# EAGLE design Node_1 (EAGLE 9.6.2)
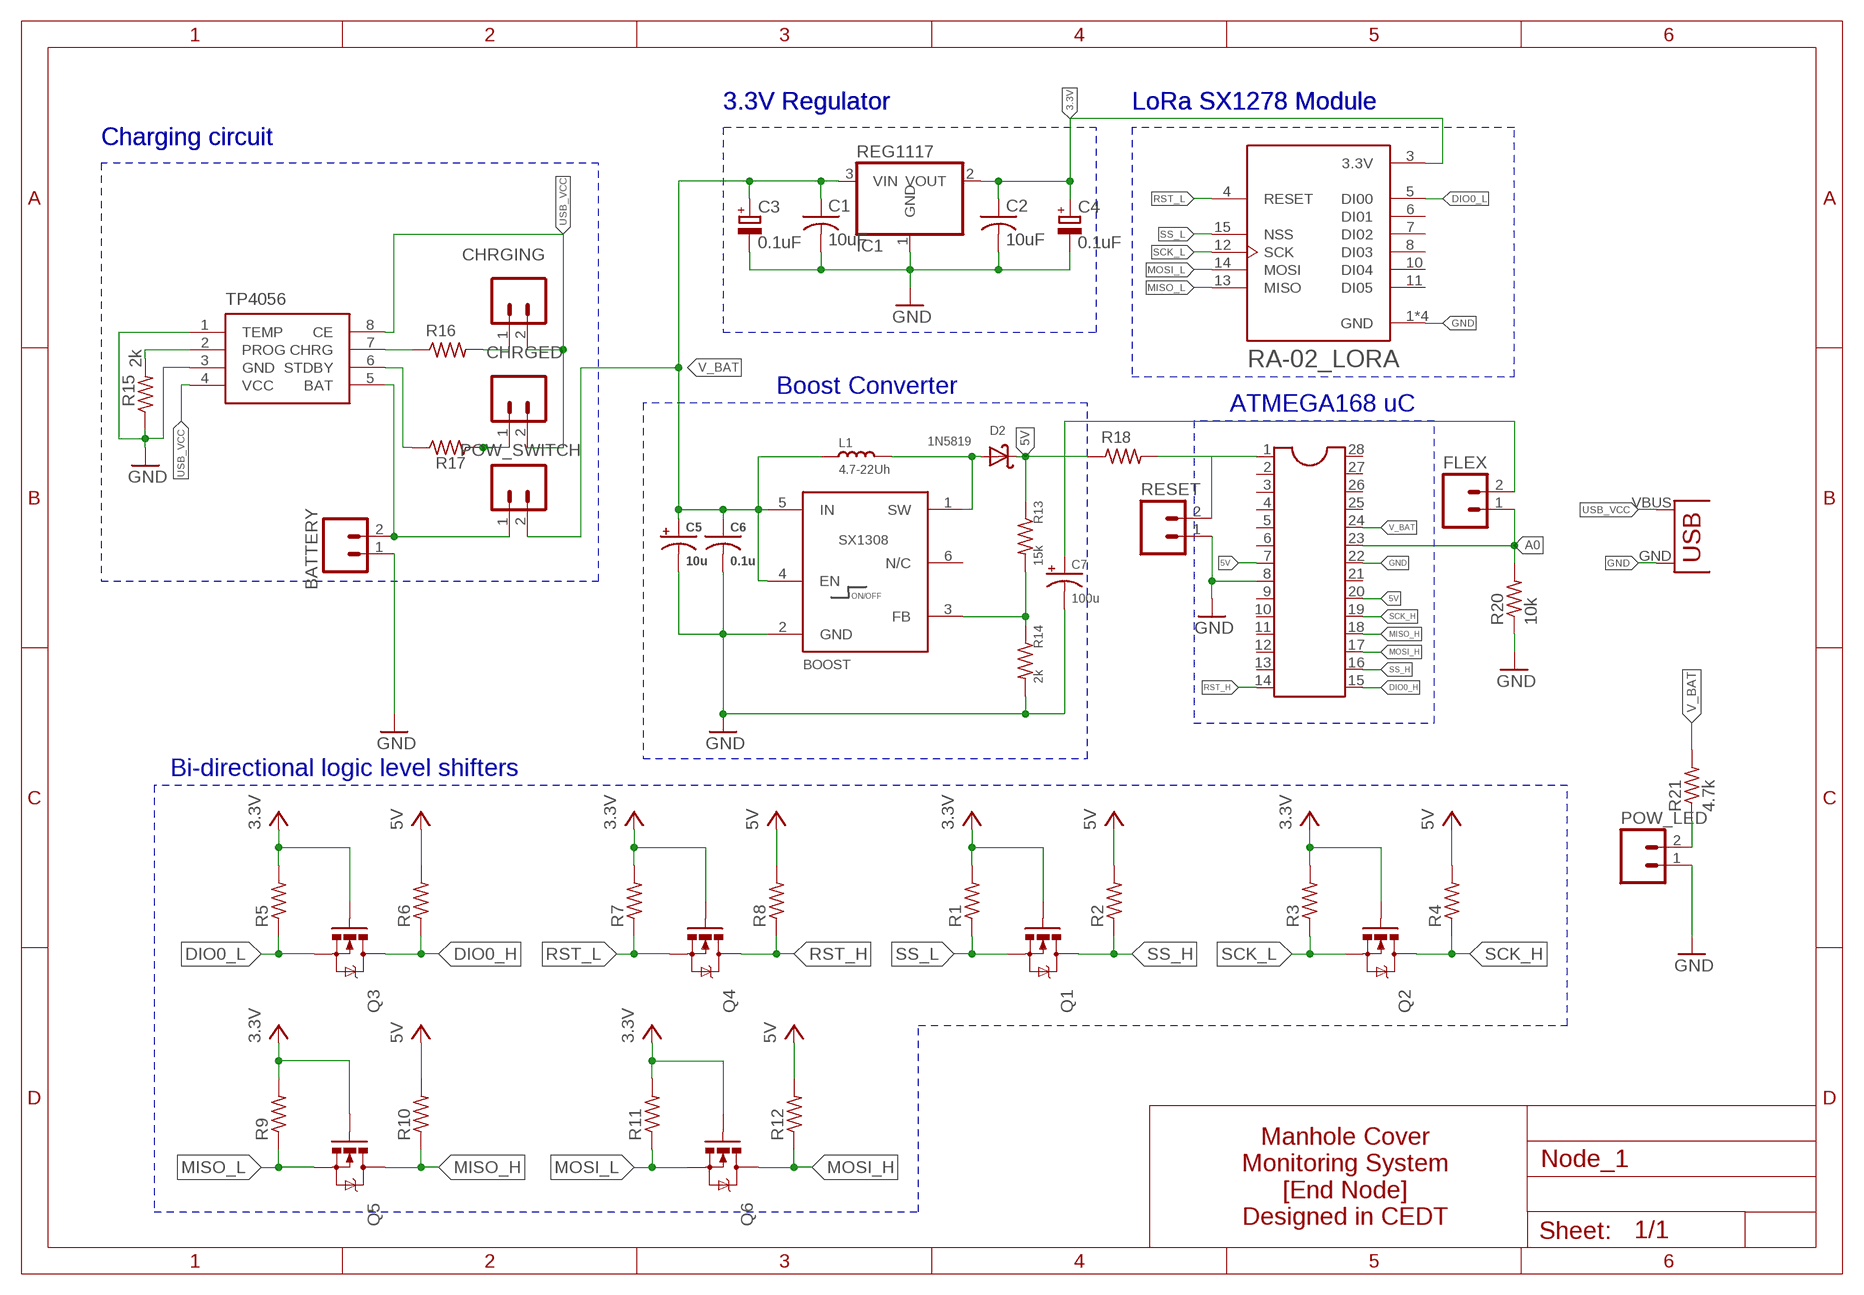
[diagram p0: schematic, sheet 1]

## Parts
ATMEGA168  DIL28-3  [DIL28-3]
BATTERY  M02  [02P]
BOOST  SX1308  [SOT-23-6]
C1  10uF  CAP0805  [C0805]
C2  10uF  CAP0805  [C0805]
C3  0.1uF  C-POL_TANTALUM-1411(3528-METRIC)  [CAPMP3528X210N]
C4  0.1uF  C-POL_TANTALUM-1411(3528-METRIC)  [CAPMP3528X210N]
C5  10u  CAP_POL_16V  [B/3528-21R]
C6  0.1u  CAP0603  [C0603]
C7  100u  CAP_POL_10V  [C/6032-28R]
CHRGED  M02  [02P]
CHRGING  M02  [02P]
D2  1N5819  [DO41-10]
FLEX  M02  [02P]
IC1  REG1117  [SOT223]
L1  4.7-22Uh  INDUCTOR/FERRITE-BEAD6X8H  [INDUCTOR_INT2-3.5-D6.5XH8.0MM]
POW_LED  M02  [02P]
POW_SWITCH  M02  [02P]
Q1  MOSFET-NCHANNELBSS138  [SOT23]
Q2  MOSFET-NCHANNELBSS138  [SOT23]
Q3  MOSFET-NCHANNELBSS138  [SOT23]
Q4  MOSFET-NCHANNELBSS138  [SOT23]
Q5  MOSFET-NCHANNELBSS138  [SOT23]
Q6  MOSFET-NCHANNELBSS138  [SOT23]
R1  RESISTOR0805  [R0805]
R2  RESISTOR0805  [R0805]
R3  RESISTOR0805  [R0805]
R4  RESISTOR0805  [R0805]
R5  RESISTOR0805  [R0805]
R6  RESISTOR0805  [R0805]
R7  RESISTOR0805  [R0805]
R8  RESISTOR0805  [R0805]
R9  RESISTOR0805  [R0805]
R10  RESISTOR0805  [R0805]
R11  RESISTOR0805  [R0805]
R12  RESISTOR0805  [R0805]
R13  15k  R-US_M0805  [M0805]
R14  2k  R-US_M0805  [M0805]
R15  2k  RESISTOR0805  [R0805]
R16  470  RESISTOR0207/7  [0207/7]
R17  470  RESISTOR0207/7  [0207/7]
R18  10k  RESISTOR0207/7  [0207/7]
R20  10k  R-US_0207/10  [0207/10]
R21  4.7k  RESISTOR0207/7  [0207/7]
RESET  M02  [02P]
TP4056  TP4056  [SOP-8]
U1  RA-02_LORA  [MODULE_RA-02_LORA]
U$1  USB(POWER)  [USB(POWER)]

## Nets
3.3V [shifter]: C2.1 C4.1(+) IC1.2(VOUT) Q1.1(G) Q2.1(G) Q3.1(G) Q4.1(G) Q5.1(G) Q6.1(G) R1.2 R3.2 R5.2 R7.2 R9.2 R11.2 U1.3(3.3V) ; supply symbol labelled VCC
5V: ATMEGA168.7 ATMEGA168.20 C7.+ D2.C FLEX.2 R2.2 R4.2 R6.2 R8.2 R10.2 R12.2 R13.1 R18.1 ; supply symbol labelled VCC
A0: ATMEGA168.23 FLEX.1 R20.2
BAT: BATTERY.2 POW_SWITCH.1 TP4056.5(BAT)
DIO0_H [shifter]: ATMEGA168.15 Q3.3(D) R6.1
DIO0_L [shifter]: Q3.2(S) R5.1 U1.5(DI00)
GND: ATMEGA168.8 ATMEGA168.22 BATTERY.1 BOOST.2(GND) C1.2 C2.2 C3.2(-) C4.2(-) C5.- C6.2 C7.- IC1.1(GND) POW_LED.1 R14.2 R15.1 R20.1 RESET.1 TP4056.1(TEMP) TP4056.3(GND) U1.1(GND) U1.2(GND) U1.9(GND) U1.16(GND) U$1.GND
MISO_H [shifter]: ATMEGA168.18 Q5.3(D) R10.1
MISO_L [shifter]: Q5.2(S) R9.1 U1.13(MISO)
MOSI_H [shifter]: ATMEGA168.17 Q6.3(D) R12.1
MOSI_L [shifter]: Q6.2(S) R11.1 U1.14(MOSI)
N$1: BOOST.1(SW) D2.A L1.2
N$2: R15.2 TP4056.2(PROG)
N$3: R16.1 TP4056.7(CHRG)
N$4: POW_LED.2 R21.1
N$6: BOOST.3(FB) R13.2 R14.1
N$7: R17.1 TP4056.6(STDBY)
N$8: CHRGING.1 R16.2
N$9: ATMEGA168.1 R18.2 RESET.2
N$10: CHRGED.1 R17.2
RST_H [shifter]: ATMEGA168.14 Q4.3(D) R8.1
RST_L [shifter]: Q4.2(S) R7.1 U1.4(RESET)
SCK_H [shifter]: ATMEGA168.19 Q2.3(D) R4.1
SCK_L [shifter]: Q2.2(S) R3.1 U1.12(SCK)
SS_H [shifter]: ATMEGA168.16 Q1.3(D) R2.1
SS_L [shifter]: Q1.2(S) R1.1 U1.15(NSS)
USB_VCC: CHRGED.2 CHRGING.2 TP4056.4(VCC) TP4056.8(CE) U$1.VBUS(VCC)
V_BAT: ATMEGA168.24 BOOST.4(EN) BOOST.5(IN) C1.1 C3.1(+) C5.+ C6.1 IC1.3(VIN) L1.1 POW_SWITCH.2 R21.2
Unconnected: ATMEGA168.2 ATMEGA168.3 ATMEGA168.4 ATMEGA168.5 ATMEGA168.6 ATMEGA168.9 ATMEGA168.10 ATMEGA168.11 ATMEGA168.12 ATMEGA168.13 ATMEGA168.21 ATMEGA168.25 ATMEGA168.26 ATMEGA168.27 ATMEGA168.28 BOOST.6(N/C) U1.6(DI01) U1.7(DI02) U1.8(DI03) U1.10(DI04) U1.11(DI05)

## Notes on the sheet
- 3.3V Regulator | 3.3V Regulator | LoRa SX1278 Module | LoRa SX1278 Module
- Charging circuit | Charging circuit
- Boost Converter
- ATMEGA168 uC
- Bi-directional logic level shifters
- Manhole Cover
  Monitoring System
  [End Node]
  Designed in CEDT

## Library data of the parts
ATMEGA168 = ic-package:DIL28: Dual In Line
BATTERY CHRGED CHRGING FLEX POW_LED POW_SWITCH RESET = CEDT_JANUARY_2015_v6:M02: AMP QUICK CONNECTOR
BOOST = SX1308:SX1308: SX1308 – 1.2MHz, 2A Step Up Converter – Suosemi; AVAILABILITY: Unavailable; DESCRIPTION: RF IC Gateway GPS 64-QFN (9x9); MF: Semtech Corporation; MP: SX1308; PACKAGE: - Semtech Corporation; PRICE: None
C1 C2 = CEDT_JANUARY_2015_v6:CAP
C3 C4 = Capacitor:C-POL: Capacitor Polarised - Generic; CATEGORY: Capacitor
C5 = CEDT_JANUARY_2015_v5:CAP_POL
C6 = CEDT_JANUARY_2015_v5:CAP
C7 = CEDT_JANUARY_2015_v7:CAP_POL; OC_FARNELL: unknown
D2 = CEDT_JANUARY_2015_v5:1N5819: DIODE general purpose rectifier, 1 A; OC_FARNELL: unknown
IC1 = CEDT_JANUARY_2015_v6:REG1117: 800mA and 1A Low Dropout (LDO) Positive Regulator 1.8V, 2.5V, 2.85V, 3.3V, 5V, and Adj
L1 = BeagleBone_Blue_R3:INDUCTOR/FERRITE-BEAD
Q1-Q6 = BeagleBone_Blue_R3:MOSFET-NCHANNEL: Common NMOSFET Parts MFG P/N Store ID Prod ID FDD8780 TRANS-09984 SI7820DN TRANS-11055 FDS6630A IC-08089 2N7002PW TRANS-11151 FQP30N06L COM-10213 TRANS-10060 BSS123LT1G TRANS-08345 BSS138 TRANS-00830 BS170 2N7000; PROD_ID: TRANS-00830
R1-R12 R21 = CEDT_JANUARY_2015_v6:RESISTOR
R13 R14 R20 = rcl:R-US_: RESISTOR, American symbol; SPICEPREFIX: R
R15 = CEDT_JANUARY_2015_v6:RESISTOR; OC_FARNELL: unknown
R16-R18 = CEDT_JANUARY_2015_v5:RESISTOR; OC_FARNELL: unknown
TP4056 = TP4056:TP4056
U1 = RA-02_LORA:RA-02_LORA: Ra-02 LoRa RF M5Stack Platform Evaluation Expansion Board Check availability <https://pricing.snapeda.com/parts/Ra-02%20LoRa/AI-Thinker/view-part?ref=eda>; AVAILABILITY: In Stock; DESCRIPTION: Ra-02 LoRa RF M5Stack Platform Evaluation Expansion Board; MF: AI-Thinker; MP: Ra-02 LoRa; PACKAGE: None; PRICE: None; PURCHASE-URL: https://pricing.snapeda.com/search/part/Ra-02 LoRa/?ref=eda
U$1 = CEDT_JANUARY_2015_v6:USB(POWER)

## Net classes
0 default: width 0.406 mm
1 POWER: width 0.61 mm, drill 0.7 mm, clearance 0.25 mm
2 shifter: width 0.305 mm

## Board
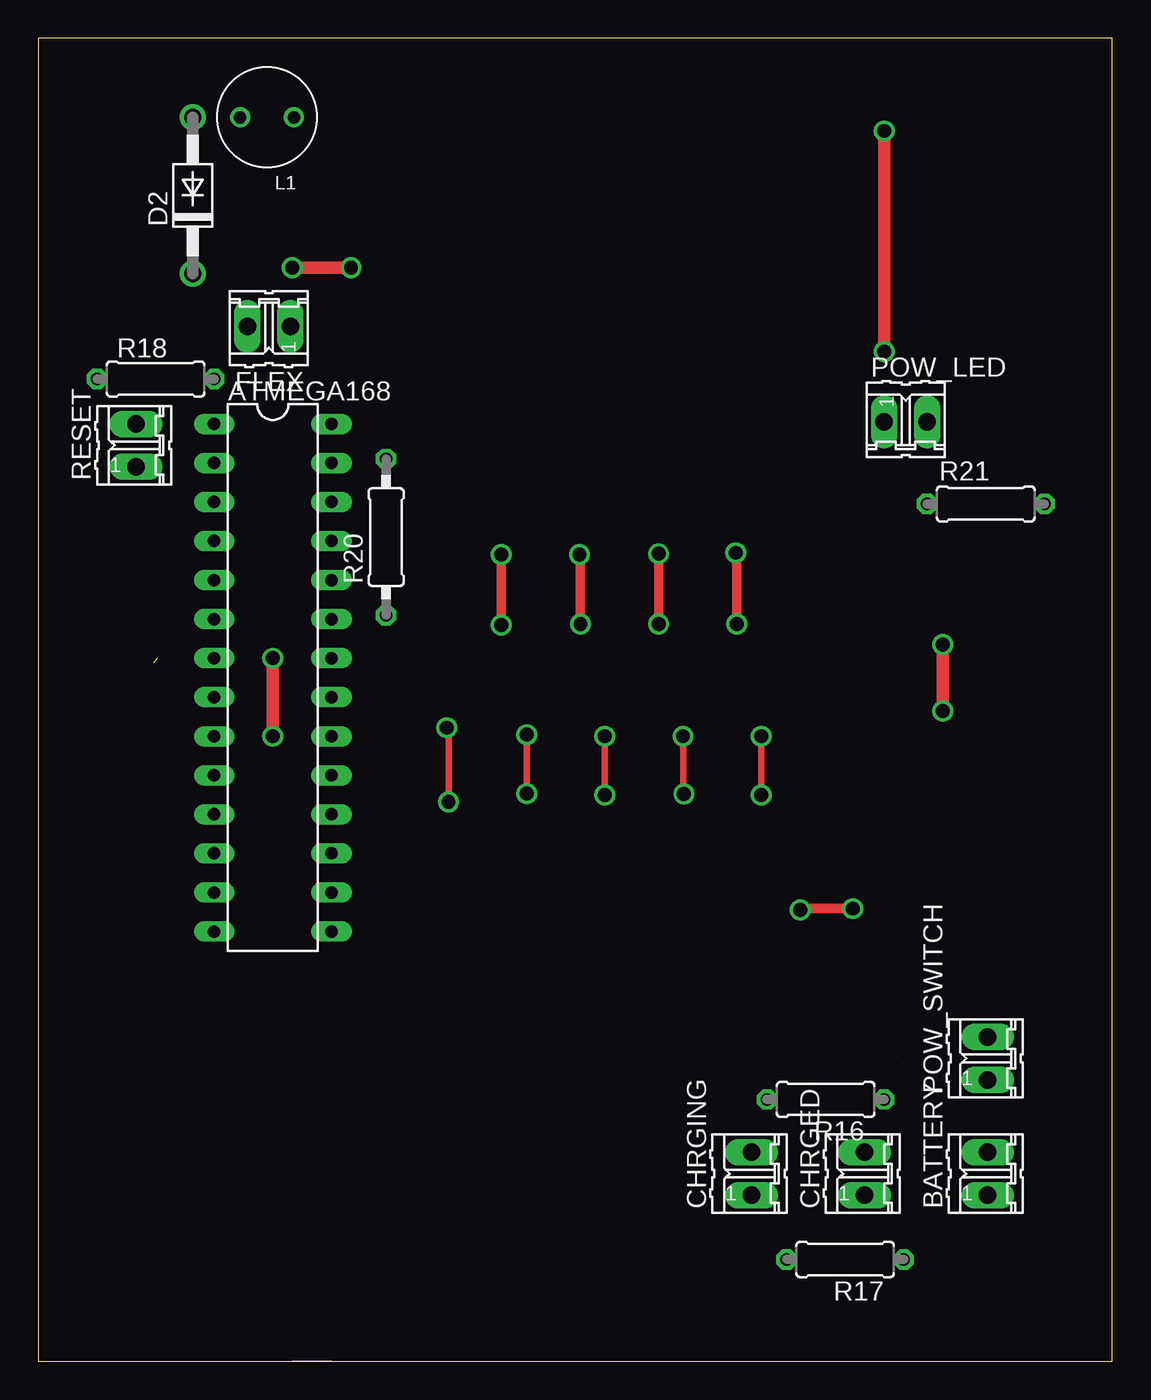
[diagram p1: board, top side]
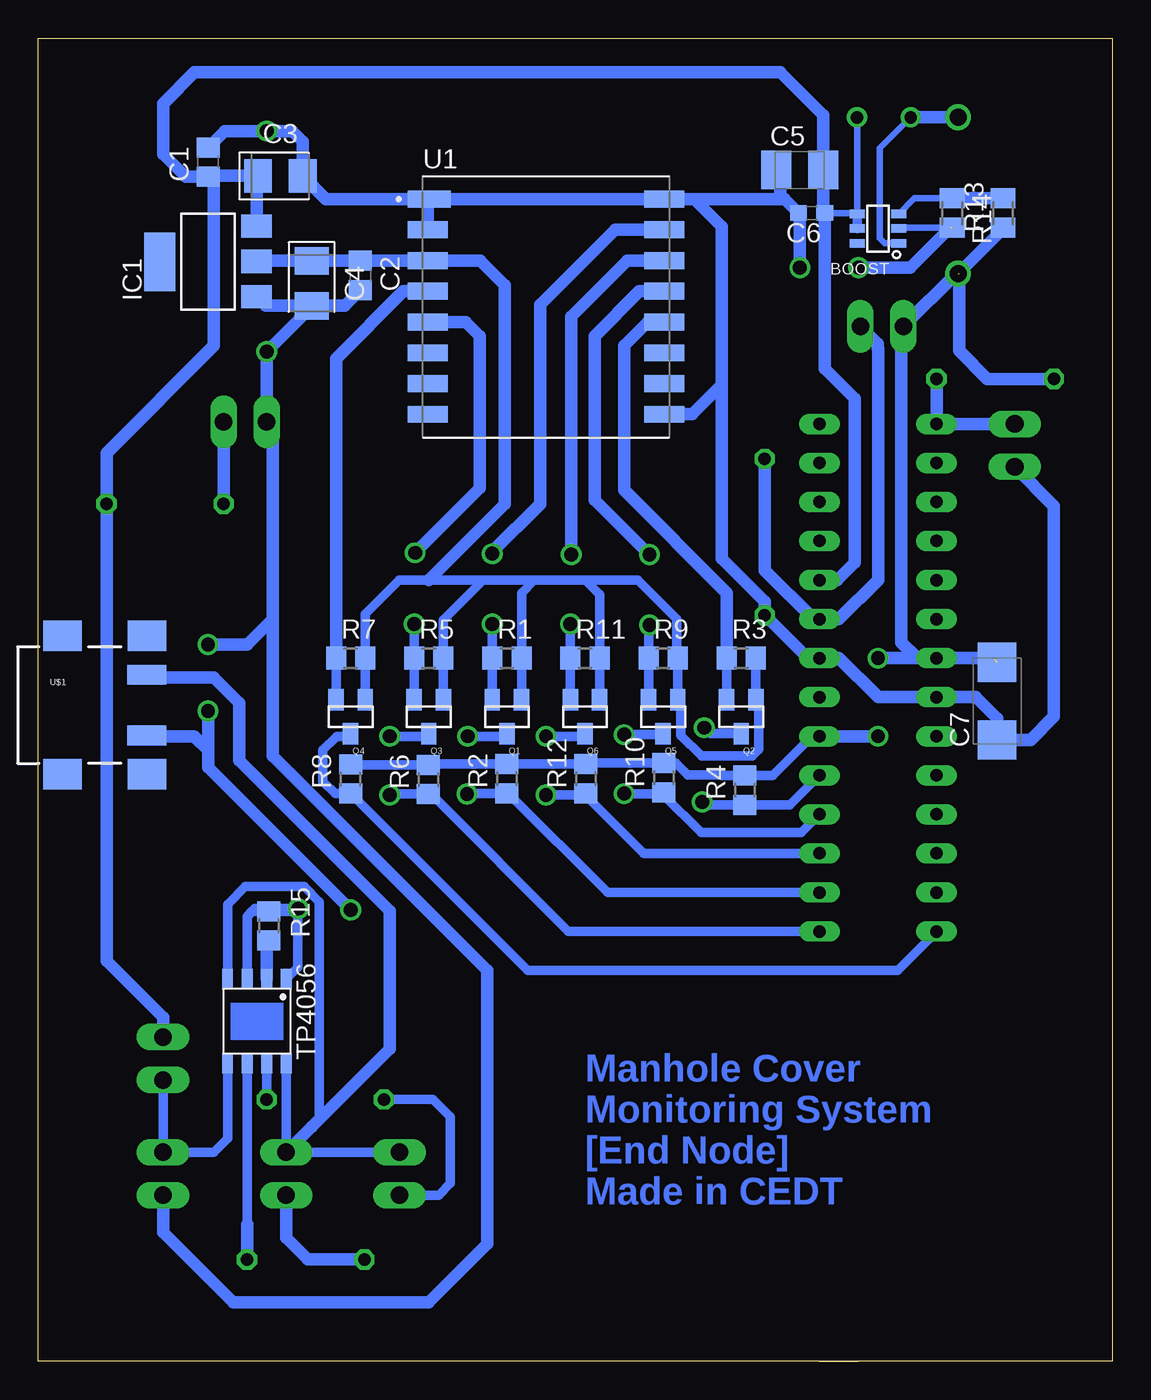
[diagram p2: board, bottom side, seen from below]

Size 69.83 x 86.03 mm. Coordinates in mm from the lower left corner, seen from the top.
Outline: 19.05,0 69.83,0 69.83,86.03 0,86.03 0,16.51 0,0 16.51,0 19.05,0
Copper layers (1*16): Top 0.035mm / dielectric 1.5mm / Bottom 0.035mm
Design rules "default *": minimum track width 6mil, minimum drill 0.35mm, track to track 12mil, track to pad 12mil, pad to pad 12mil, via to via 12mil, smd to smd 12mil, copper to edge 40mil, drill to drill 6mil, minimum pad ring 10mil, minimum via ring 8mil, stop-mask expansion 4mil, vias tented up to drill 0mil, thermal gap 10mil

### Footprints (pad centres in the part's own frame; a part is rotated, then mirrored left to right if it is on the bottom)
DIL28-3 = drill 0.813 long: 1 -16.51,-3.81; 2 -13.97,-3.81; 3 -11.43,-3.81; 4 -8.89,-3.81; 5 -6.35,-3.81; 6 -3.81,-3.81; 7 -1.27,-3.81; 8 1.27,-3.81; 9 3.81,-3.81; 10 6.35,-3.81; 11 8.89,-3.81; 12 11.43,-3.81; 13 13.97,-3.81; 14 16.51,-3.81; 15 16.51,3.81; 16 13.97,3.81; 17 11.43,3.81; 18 8.89,3.81; 19 6.35,3.81; 20 3.81,3.81; 21 1.27,3.81; 22 -1.27,3.81; 23 -3.81,3.81; 24 -6.35,3.81; 25 -8.89,3.81; 26 -11.43,3.81; 27 -13.97,3.81; 28 -16.51,3.81
02P = drill 1.143 long: 1 -1.397,0; 2 1.397,0
SOT-23-6 = smd 1 x 0.55: 1 -1.35,0.95; 2 -1.35,0; 3 -1.35,-0.95; 4 1.35,-0.95; 5 1.35,0; 6 1.35,0.95
C0805 = smd 1.3 x 1.5: 1 -0.95,0; 2 0.95,0
CAPMP3528X210N = smd 1.796 x 2.204: 1 -1.46,0; 2 1.46,0
B/3528-21R = smd 1.95 x 2.5: + 1.525,0; - -1.525,0
C0603 = smd 1.1 x 1: 1 -0.85,0; 2 0.85,0
C/6032-28R = smd 2.55 x 2.5: + 2.525,0; - -2.525,0
DO41-10 = drill 1.118: A 5.08,0; C -5.08,0
SOT223 = smd 1.499 x 2.007: 1 -2.261,-3.15; 2 0.025,-3.15; 3 2.311,-3.15 | smd 3.81 x 2.007: 4 0,3.15
INDUCTOR_INT2-3.5-D6.5XH8.0MM = drill 0.8: 1 -1.75,0; 2 1.75,0
SOT23 = smd 1 x 1.4: 1 -0.95,-1.1; 2 0.95,-1.1; 3 0,1.1
R0805 = smd 1.3 x 1.5: 1 -0.95,0; 2 0.95,0
M0805 = smd 1.3 x 1.6: 1 -0.95,0; 2 0.95,0
0207/7 = drill 0.813 octagon: 1 -3.81,0; 2 3.81,0
0207/10 = drill 0.813 octagon: 1 -5.08,0; 2 5.08,0
SOP-8 = smd 1.3 x 0.7: 1 -2.75,1.905; 2 -2.75,0.635; 3 -2.75,-0.635; 4 -2.75,-1.905; 5 2.75,-1.905; 6 2.75,-0.635; 7 2.75,0.635; 8 2.75,1.905
MODULE_RA-02_LORA = smd 2.8 x 1.1: 1 -7.6,7 | smd 2.6 x 1.1: 2 -7.7,5; 3 -7.7,3; 4 -7.7,1; 5 -7.7,-1; 6 -7.7,-3; 7 -7.7,-5; 8 -7.7,-7; 9 7.7,-7; 10 7.7,-5; 11 7.7,-3; 12 7.7,-1; 13 7.7,1; 14 7.7,3; 15 7.7,5; 16 7.7,7
USB(POWER) = smd 2.54 x 1.27: GND 2.5,-1.981; VBUS 2.5,1.981 | smd 2.5 x 2: GND@1 -3,-4.5; GND@2 -3,4.5; GND@3 2.5,4.5; GND@4 2.5,-4.5

### Placement (x,y rotation side)
ATMEGA168  15.24,44.45 270 top
BATTERY  61.72,12.19 90 top
BOOST  15.24,73.66 180 bottom
C1  58.8,77.98 90 bottom
C2  48.9,70.61 270 bottom
C3  54.1,77.09 0 bottom
C4  52.07,70.1 270 bottom
C5  20.32,77.47 0 bottom
C6  19.56,74.68 180 bottom
C7  7.49,42.93 90 bottom
CHRGED  53.72,12.19 90 top
CHRGING  46.36,12.19 90 top
D2  10.03,75.82 90 top
FLEX  14.99,67.31 180 top
IC1  58.8,71.5 90 bottom
L1  14.86,80.9 180 top
POW_LED  56.39,61.09 0 top
POW_SWITCH  61.72,19.68 90 top
Q1  39.37,41.91 180 bottom
Q2  24.13,41.91 180 bottom
Q3  44.45,41.91 180 bottom
Q4  49.53,41.91 180 bottom
Q5  29.21,41.91 180 bottom
Q6  34.29,41.91 180 bottom
R1  39.37,45.72 0 bottom
R2  39.37,37.88 90 bottom
R3  24.13,45.72 0 bottom
R4  23.89,37.13 90 bottom
R5  44.45,45.72 0 bottom
R6  44.47,37.82 90 bottom
R7  49.53,45.72 0 bottom
R8  49.53,37.85 90 bottom
R9  29.21,45.72 0 bottom
R10  29.16,37.94 90 bottom
R11  34.29,45.72 0 bottom
R12  34.23,37.87 90 bottom
R13  7.11,74.68 90 bottom
R14  10.41,74.68 270 bottom
R15  54.85,28.31 270 bottom
R16  51.18,17.02 180 top
R17  52.45,6.6 180 top
R18  7.62,63.88 0 top
R20  22.61,53.59 90 top
R21  61.59,55.75 0 top
RESET  6.35,59.56 90 top
TP4056  55.63,22.1 270 bottom
U1  36.83,68.58 0 bottom
U$1  65.28,42.67 0 bottom

### Tracks (layer width: path | path; a pad name or v marks a point on that pad's centre or on a via)
3.3V
  Bottom 0.305: Q2.1 23.18,42.9 | 28.09,43.18 Q5.1 | 33.4,48.39 33.34,48.33
  Bottom 0.406: Q5.1 28.26,42.67 28.06,42.48 | Q2.1 23.09,42.92 23.05,42.92 22.99,42.86
  Bottom 0.61: Q5.1 R9.2 28.32,45.78 28.32,48.26 30.86,50.8 34.29,50.8 | Q2.1 R3.2 | Q6.1 R11.2 33.34,48.33 33.34,49.85 34.29,50.8 | Q1.1 R1.2 38.42,49.97 37.59,50.8 | Q3.1 R5.2 43.5,48.2 40.89,50.8 | Q4.1 R7.2 48.58,48.57 46.36,50.8 44.45,50.8 40.89,50.8 | 34.29,50.8 37.59,50.8 | 37.59,50.8 40.89,50.8 | 22.99,42.86 22.99,39.77 23.42,39.35 26.71,39.35 28.06,40.7 28.06,42.48
  Bottom 0.813: IC1.2 55.61,71.56 C4.1 C2.1 48.88,71.58 U1.3 41.1,71.58 39.5,69.98 39.5,55.75 44.45,50.8
5V  (via drill 0.9)  (2 unrouted)
  Top 0.813: v15.24,45.72 v15.24,40.64
  Bottom 0.406: R4.2 24.11,38.08 | 25.46,38.12 25.42,38.08 | 34.16,38.89 R12.2 | 39.36,38.82 R2.2 | 44.41,38.83 R6.2 | 49.5,38.77 R8.2 | 19.54,40.64 ATMEGA168.20
  Bottom 0.61: 25.42,38.08 R4.2 22.1,38.08 19.54,40.64 | 25.46,38.12 27.61,38.12 28.38,38.89 R10.2 34.16,38.89 | R12.2 39.36,38.82 | R2.2 44.41,38.83 | R6.2 49.5,38.77
  Bottom 0.813: 7.76,45.72 ATMEGA168.7 12.7,45.72 | 12.7,45.72 v15.24,45.72 | v15.24,40.64 ATMEGA168.20 | 12.7,45.72 13.72,46.74 13.72,67.18 FLEX.2 10.16,70.74 D2.C | 10.03,70.8 D2.C | R18.1 8.13,63.88 9.97,65.72 9.97,70.74 | R13.1 7.11,73.66 D2.C
A0
  Bottom 0.813: FLEX.1 15.26,66.19 15.26,65.87 15.24,65.85 15.24,50.8 17.78,48.26 ATMEGA168.23 19.43,48.26 22.61,51.43 R20.2
BAT
  Bottom 0.61: TP4056.5 57.53,14.48 58.42,13.59 BATTERY.2 POW_SWITCH.1
DIO0_H  (via drill 0.9)
  Top 0.406: v46.99,36.83 v46.99,40.64
  Bottom 0.406: 46.95,36.87 v46.99,36.83 | 44.62,40.64 Q3.3
  Bottom 0.61: ATMEGA168.15 35.37,27.94 44.3,36.87 R6.1 46.95,36.87 | v46.99,40.64 44.62,40.64
DIO0_L  (via drill 0.9)
  Top 0.61: v45.4,47.94 45.4,52.52 v45.34,52.58
  Bottom 0.61: Q3.2 R5.1 v45.4,47.94 45.34,48.01
  Bottom 0.813: U1.5 42.05,67.58 41.15,66.67 41.15,56.77 v45.34,52.58
GND  (via drill 0.9, 0.9 pad 0.9)  (1 unrouted)
  Top 0.61: v52.94,29.43 52.92,29.46 49.65,29.46 v49.53,29.34
  Top 0.813: v16.51,71.12 v20.32,71.12 | v58.8,42.29 v58.8,46.61 | v54.99,65.66 v54.99,80.01 54.99,80.14
  Bottom 0.406: BOOST.2 13.82,73.73 R14.2
  Bottom 0.61: TP4056.3 | TP4056.3 56.26,28.93 55.92,29.26 | TP4056.1 52.98,25.59 52.98,29.39 v52.94,29.43 | v52.94,29.43 54.68,29.43 | 54.68,29.43 R15.1 | R15.1 55.92,29.26 | 55.92,29.26 55.76,29.43 54.68,29.43 | R15.1 53.11,29.26 v52.94,29.43
  Bottom 0.813: IC1.1 55.05,68.64 C4.2 | C2.2 49.91,68.64 C4.2 | U1.16 U1.1 | U1.1 44.53,75.48 U1.2 | U1.16 27.19,75.58 25.4,73.79 25.4,63.5 | 25.4,63.5 27.32,61.58 U1.9 29.21,61.5 | C1.2 57.72,80.01 v54.99,80.01 53.34,80.01 52.64,79.31 C3.2 51.13,75.58 U1.1 | C6.2 21.59,75.86 21.59,77.47 C5.- | 10.54,73.73 13.15,71.12 v16.51,71.12 | U1.16 21.31,75.58 C6.2 | v20.32,71.12 20.32,74.59 C6.2 | 58.8,39.75 59.69,40.64 62.73,40.64 U$1.GND | C4.2 52.07,68.58 v54.99,65.66 POW_LED.1 54.61,60.71 54.61,48.26 | 58.8,39.75 v58.8,42.29 | 25.4,63.5 25.4,52.2 22.61,49.4 R20.1 19.81,45.72 ATMEGA168.22 17.78,45.72 15.24,43.18 ATMEGA168.8 8.89,43.18 7.49,41.78 C7.- 5.32,40.4 3.81,41.91 3.81,55.63 RESET.1 | BATTERY.1 61.72,8.38 57.15,3.81 44.45,3.81 40.64,7.62 40.64,25.4 54.61,39.37 54.61,48.26 | v58.8,46.61 56.26,46.61 54.61,48.26 | v49.53,29.34 58.8,38.61 58.8,39.75
MISO_H  (via drill 0.9)
  Top 0.406: v31.75,36.91 v31.75,40.75
  Bottom 0.406: 29.27,36.88 R10.1 29.16,36.78 | 31.72,36.88 v31.75,36.91 | 29.27,40.75 Q5.3
  Bottom 0.61: 31.72,36.88 29.27,36.88 | ATMEGA168.18 20.24,34.37 26.75,34.37 29.16,36.78 | v31.75,40.75 29.27,40.75
MISO_L  (via drill 0.9 pad 0.9)
  Top 0.61: v30.1,47.88 v30.1,52.45
  Bottom 0.61: Q5.2 R9.1 30.16,47.69 30.23,47.75 v30.1,47.88
  Bottom 0.813: U1.13 30.75,69.58 33.66,66.67 33.66,56.01 v30.1,52.45
MOSI_H  (via drill 0.9)
  Top 0.406: v36.83,36.83 v36.83,40.64
  Bottom 0.406: R12.1 34.33,36.83 | 34.46,40.64 Q6.3
  Bottom 0.61: ATMEGA168.17 30.48,33.02 34.23,36.77 R12.1 | 34.33,36.83 v36.83,36.83 | v36.83,40.64 34.46,40.64
MOSI_L  (via drill 0.9 pad 0.9)
  Top 0.61: v35.24,47.94 35.24,52.39 v35.18,52.45
  Bottom 0.61: Q6.2 R11.1 35.24,47.81 35.31,47.88 v35.24,47.94
  Bottom 0.813: U1.14 31.54,71.58 35.18,67.94 v35.18,52.45
N$1
  Bottom 0.406: BOOST.1 14.8,72.71 15.11,73.02 15.11,78.89 L1.2
  Bottom 0.813: D2.A L1.2
N$2
  Bottom 0.813: R15.2 54.85,27.29 54.99,27.15 TP4056.2
N$3
  Bottom 0.61: TP4056.7 R16.1
N$4
  Bottom 0.813: POW_LED.2 R21.1
N$6
  Bottom 0.406: BOOST.3 12.87,75.63 R14.1
  Bottom 0.813: R13.2 R14.1
N$7  (1 unrouted)
  Bottom 0.61: TP4056.6 56.26,8.89 56.26,8.38
  Bottom 0.813: R17.1 56.26,8.89
N$8
  Bottom 0.61: R16.2 44.2,17.02 43.05,15.87 43.05,11.56 43.82,10.79 CHRGING.1
N$9
  Bottom 0.813: R18.2 ATMEGA168.1 RESET.2
N$10
  Bottom 0.813: CHRGED.1 53.72,8 52.32,6.6 R17.2
RST_H
  Bottom 0.406: Q4.3 49.7,40.64
  Bottom 0.61: ATMEGA168.14 13.97,25.4 38.02,25.4 R8.1 50.53,36.9 51.34,37.71 51.34,39.75 50.45,40.64 49.7,40.64
RST_L
  Bottom 0.61: R7.1 Q4.2
  Bottom 0.813: U1.4 46.12,69.58 50.48,65.22 R7.1
SCK_H  (via drill 0.9)
  Top 0.406: v26.66,36.36 26.66,41.2 v26.54,41.2
  Bottom 0.406: v26.54,41.2 26.15,40.81
  Bottom 0.61: ATMEGA168.19 20.97,36.18 R4.1 26.48,36.18 v26.66,36.36 | 26.15,40.81 Q2.3
SCK_L
  Bottom 0.61: Q2.2 R3.1
  Bottom 0.813: U1.12 30.21,67.58 31.75,66.04 31.75,56.64 25.08,49.97 R3.1
SS_H  (via drill 0.9)
  Top 0.406: v41.97,36.89 41.91,36.95 v41.91,40.64
  Bottom 0.406: 41.91,36.93 41.92,36.94 v41.97,36.89 | 39.54,40.64 Q1.3
  Bottom 0.61: ATMEGA168.16 32.83,30.48 39.28,36.93 R2.1 41.91,36.93 | v41.91,40.64 39.54,40.64
SS_L  (via drill 0.9 pad 0.9)
  Top 0.61: v40.32,47.94 40.32,52.39 40.39,52.45 v40.32,52.52
  Bottom 0.61: Q1.2 R1.1 40.32,47.81 40.39,47.88 v40.32,47.94
  Bottom 0.813: U1.15 32.34,73.58 37.21,68.71 37.21,55.75 40.32,52.64 v40.32,52.52
USB_VCC
  Bottom 0.61: TP4056.8 CHRGED.2 CHRGING.2 | TP4056.4 57.53,29.72 56.39,30.86 52.54,30.86 51.56,29.88 51.56,15.75 52.07,15.24
  Bottom 0.813: U$1.VBUS 62.58,44.45 58.42,44.45 56.77,42.8 56.77,39.07 46.99,29.29 46.99,20.32 52.07,15.24 CHRGED.2
V_BAT
  Bottom 0.406: L1.1 16.59,80.88 BOOST.4 16.66,74.68 C6.1
  Bottom 0.61: BOOST.5 BOOST.4
  Bottom 0.813: IC1.3 55.65,77 C3.1 58.74,77.09 | 58.74,77.09 C1.1 60.26,77.03 61.72,78.49 61.72,81.79 59.69,83.82 21.59,83.82 18.79,81.02 C5.+ 18.79,74.76 C6.1 18.71,64.55 16.76,62.61 16.76,51.94 17.91,50.8 ATMEGA168.24 | 58.74,77.09 58.42,76.77 58.42,66.04 65.41,59.05 R21.2 65.41,26.04 61.72,22.35 POW_SWITCH.2

### Text on the board
Bottom: Manhole Cover / Monitoring System / [End Node] / Made in CEDT